# Altium schematic sheet Synchronous Buck Solar Charge Controller Board.SchDoc
size OrCAD B
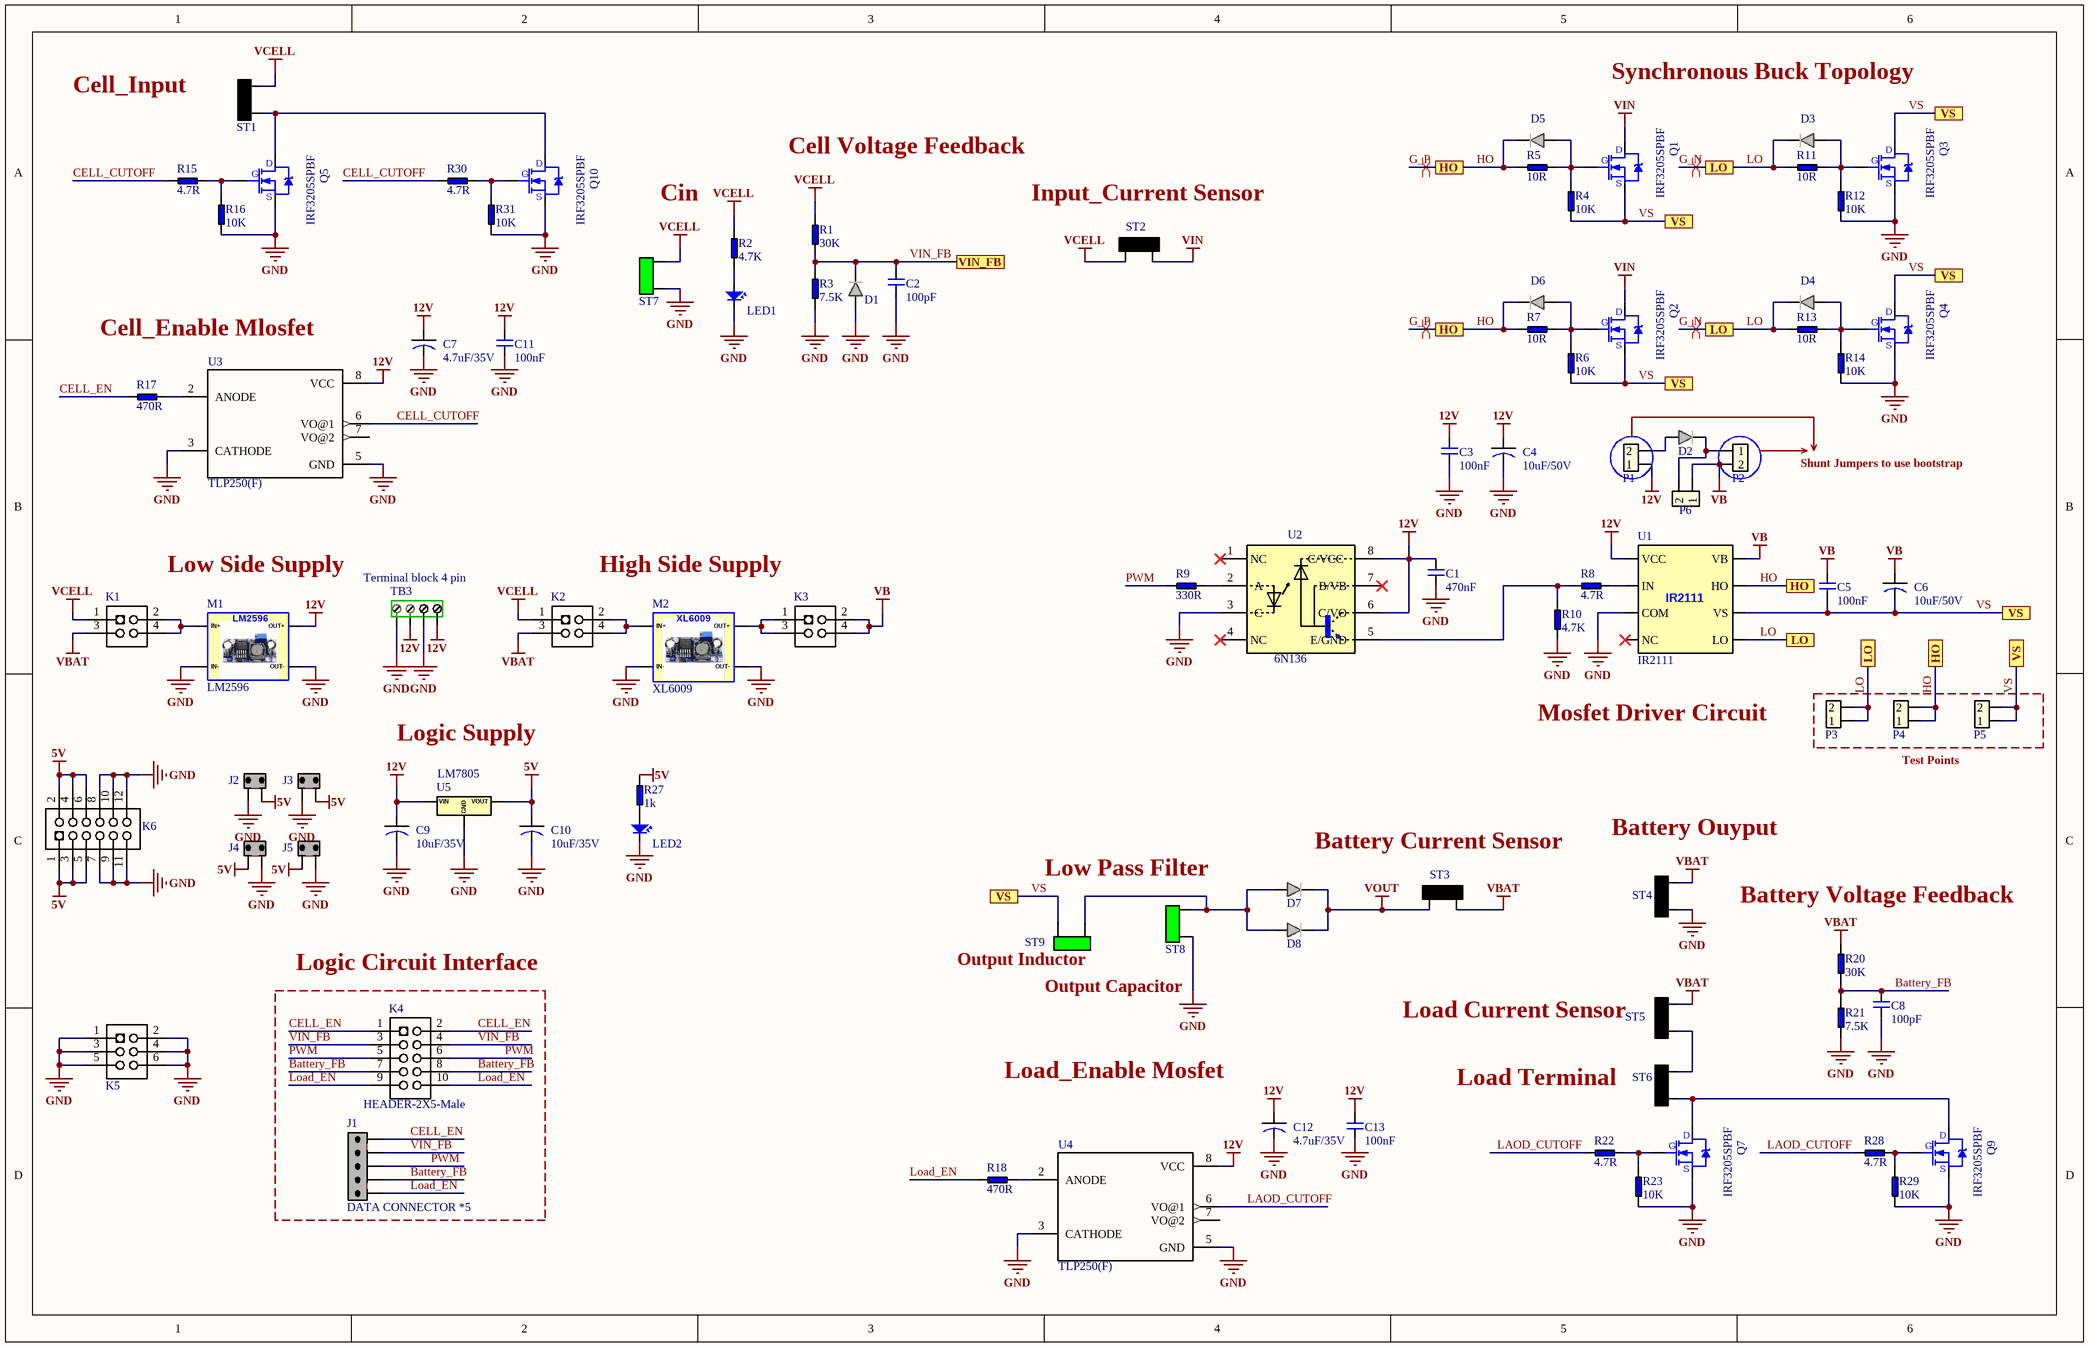
[diagram p0: Synchronous Buck Solar Charge Controller Board.SchDoc]

## Parts
C1  470nF  [CCAP 0.1 N Y]
C2  100pF  [CCAP 0.1 N Y]
C3  100nF  [CCAP 0.1 N Y]
C4  10uF/50V  [ECAP 5X11X2MM]
C5  100nF  [CCAP 0.1 N Y]
C6  10uF/50V  [ECAP 5X11X2MM]
C7  4.7uF/35V  [ECAP 5X11X2MM]
C8  100pF  [CCAP 0.1 N Y]
C9  10uF/35V  [ECAP 5X11X2MM]
C10  10uF/35V  [ECAP 5X11X2MM]
C11  100nF  [CCAP 0.1 N Y]
C12  4.7uF/35V  [ECAP 5X11X2MM]
C13  100nF  [CCAP 0.1 N Y]
D1  DIODE  [DIODE-1N400X_0.1]  (value not drawn)
D2  DIODE  [DIODE-1n400X_0.3]  (value not drawn)
D3  DIODE  [DIODE-1n400X_0.3]  (value not drawn)
D4  DIODE  [DIODE-1n400X_0.3]  (value not drawn)
D5  DIODE  [DIODE-1n400X_0.3]  (value not drawn)
D6  DIODE  [DIODE-1n400X_0.3]  (value not drawn)
D7  10A DIODE  [DIODE 10A 0.75]  (value not drawn)
D8  10A DIODE  [DIODE 10A 0.75]  (value not drawn)
J1  DATA CONNECTOR *5  [MOLEX *5_DATA CONNECTOR]
J2  DATA CONNECTOR *2  [MOLEX *2_DATA CONNECTOR]  (value not drawn)
J3  DATA CONNECTOR *2  [MOLEX *2_DATA CONNECTOR]  (value not drawn)
J4  DATA CONNECTOR *2  [MOLEX *2_DATA CONNECTOR]  (value not drawn)
J5  DATA CONNECTOR *2  [MOLEX *2_DATA CONNECTOR]  (value not drawn)
K1  HEADER-2X2-Male  [HEADER-2X2]  (value not drawn)
K2  HEADER-2X2-Male  [HEADER-2X2]  (value not drawn)
K3  HEADER-2X2-Male  [HEADER-2X2]  (value not drawn)
K4  HEADER-2X5-Male  [HEADER-2X5]
K5  HEADER-2X3-Male  [HEADER-2X3]  (value not drawn)
K6  HEADER-2X6-Male  [HEADER-2X6]  (value not drawn)
LED1  LED  [LED 3MM GREEN]  (value not drawn)
LED2  LED  [LED 3MM BLUE]  (value not drawn)
M1  LM2596  [LM2956S BUCK CONVETER]
M2  XL6009  [DC TO DC CONVERTER XL6009]
P1  Header - 2 - Male  [PINHEADER X2]  (value not drawn)
P2  Header - 2 - Male  [PINHEADER X2]  (value not drawn)
P3  Header - 2 - Male  [PINHEADER X2]  (value not drawn)
P4  Header - 2 - Male  [PINHEADER X2]  (value not drawn)
P5  Header - 2 - Male  [PINHEADER X2]  (value not drawn)
P6  Header - 2 - Male  [PINHEADER X2]  (value not drawn)
Q1  IRF3205SPBF  [Transistor/Heatsink -TO-220]
Q2  IRF3205SPBF  [Transistor/Heatsink -TO-220]
Q3  IRF3205SPBF  [Transistor/Heatsink -TO-220]
Q4  IRF3205SPBF  [Transistor/Heatsink -TO-220]
Q5  IRF3205SPBF  [Transistor/Heatsink -TO-220]
Q7  IRF3205SPBF  [Transistor/Heatsink -TO-220]
Q9  IRF3205SPBF  [Transistor/Heatsink -TO-220]
Q10  IRF3205SPBF  [Transistor/Heatsink -TO-220]
R1  30K  [RESISTOR _0]
R2  4.7K  [RESISTOR _1]
R3  7.5K  [RESISTOR _0]
R4  10K  [RESISTOR _1]
R5  10R  [RESISTOR _1]
R6  10K  [RESISTOR _1]
R7  10R  [RESISTOR _1]
R8  4.7R  [RESISTOR _0]
R9  330R  [RESISTOR _0]
R10  4.7K  [RESISTOR _0]
R11  10R  [RESISTOR _1]
R12  10K  [RESISTOR _1]
R13  10R  [RESISTOR _1]
R14  10K  [RESISTOR _1]
R15  4.7R  [RESISTOR _0]
R16  10K  [RESISTOR _0]
R17  470R  [RESISTOR _0]
R18  470R  [RESISTOR _0]
R20  30K  [RESISTOR _1]
R21  7.5K  [RESISTOR _1]
R22  4.7R  [RESISTOR _0]
R23  10K  [RESISTOR _0]
R27  1k  [RESISTOR _0]
R28  4.7R  [RESISTOR _0]
R29  10K  [RESISTOR _0]
R30  4.7R  [RESISTOR _0]
R31  10K  [RESISTOR _0]
ST1  SCREW TERMINAL  [SCREW TERMINAL]  (value not drawn)
ST2  SCREW TERMINAL  [SCREW TERMINAL]  (value not drawn)
ST3  SCREW TERMINAL  [SCREW TERMINAL]  (value not drawn)
ST4  SCREW TERMINAL  [SCREW TERMINAL]  (value not drawn)
ST5  SCREW TERMINAL  [SCREW TERMINAL]  (value not drawn)
ST6  SCREW TERMINAL  [SCREW TERMINAL]  (value not drawn)
ST7  2 Pole Power Terminal  [Screw Terminal Green]  (value not drawn)
ST8  2 Pole Power Terminal  [Screw Terminal Green]  (value not drawn)
ST9  2 Pole Power Terminal  [Screw Terminal Green]  (value not drawn)
TB3  Terminal block 4 pin  [AK500/4_BLUE]
U1  IR2111  [IC_DIP8]
U2  6N136  [IC_DIP8]
U3  TLP250(F)  [IC_DIP8]
U4  TLP250(F)  [IC_DIP8]
U5  LM7805  [V-REG/Heatsink - TO - 220]

## Blocks framed on the sheet
Logic Circuit Interface: J1 K4

## Ports
HO, LO, VIN_FB, VS

## Nets
5V: C10.A J2.1 J3.1 J4.2 J5.2 K6.1 K6.2 K6.3 K6.4 K6.5 K6.6 R27.2 U5.3(VOUT)
12V: C1.1 C3.1 C4.A C7.A C9.A C11.1 C12.A C13.1 M1.OUT+ P1.1 TB3.1 TB3.3 U1.1(VCC) U2.6(C/VO) U2.8(C/VCC) U3.8(VCC) U4.8(VCC) U5.1(VIN)
GND: C1.2 C2.2 C3.2 C4.K C7.K C8.2 C9.K C10.K C11.2 C12.K C13.2 D1.A J2.2 J3.2 J4.1 J5.1 K5.1 K5.2 K5.3 K5.4 K5.5 K5.6 K6.7 K6.8 K6.9 K6.10 K6.11 K6.12 LED1.K LED2.K M1.IN- M1.OUT- M2.IN- M2.OUT- Q3.3(S) Q4.3(S) Q5.3(S) Q7.3(S) Q9.3(S) Q10.3(S) R3.1 R10.1 R12.1 R14.1 R16.1 R21.1 R23.1 R29.1 R31.1 ST4.1(AC) ST7.1 ST8.1 TB3.2 TB3.4 U1.3(COM) U2.3(C) U3.3(CATHODE) U3.5(GND) U4.3(CATHODE) U4.5(GND) U5.2(GND)
VB: C5.1 C6.A K3.2 K3.4 P2.2 P6.1 U1.8(VB)
VBAT: K1.3 K2.3 R20.2 ST3.1(AC) ST4.2(AC) ST5.2(AC)
VCELL: K1.1 K2.1 R1.2 R2.2 ST1.1(AC) ST2.2(AC) ST7.2
VIN: Q1.2(D) Q2.2(D) ST2.1(AC)
VOUT: D7.K D8.K ST3.2(AC)
Battery_FB: C8.1 J1.4 K4.7 K4.8 R20.1 R21.2
CELL_CUTOFF: R15.1 R30.1 U3.6(VO@1)
CELL_EN: J1.1 K4.1 K4.2 R17.1
G_N: D3.K D4.K P3.1 P3.2 R11.1 R13.1 U1.4(LO) ; port LO  [also labelled LO]
G_P: D5.K D6.K P4.1 P4.2 R5.1 R7.1 U1.7(HO) ; port HO  [also labelled HO]
LAOD_CUTOFF: R22.1 R28.1 U4.6(VO@1)
Load_EN: J1.5 K4.9 K4.10 R18.1
PWM: J1.3 K4.5 K4.6 R9.1
VIN_FB: C2.1 D1.K J1.2 K4.3 K4.4 R1.1 R3.2 ; port VIN_FB
VS: C5.2 C6.K P5.1 P5.2 Q1.3(S) Q2.3(S) Q3.2(D) Q4.2(D) R4.2 R6.2 ST9.2 U1.6(VS) ; port VS
NetD2_A: D2.A P1.2
NetD2_K: D2.K P2.1 P6.2
NetD3_A: D3.A Q3.1(G) R11.2 R12.2
NetD4_A: D4.A Q4.1(G) R13.2 R14.2
NetD5_A: D5.A Q1.1(G) R4.1 R5.2
NetD6_A: D6.A Q2.1(G) R6.1 R7.2
NetD7_A: D7.A D8.A ST8.2 ST9.1
NetK1_2: K1.2 K1.4 M1.IN+
NetK2_2: K2.2 K2.4 M2.IN+
NetK3_1: K3.1 K3.3 M2.OUT+
NetLED1_A: LED1.A R2.1
NetLED2_A: LED2.A R27.1
NetQ5_1: Q5.1(G) R15.2 R16.2
NetQ5_2: Q5.2(D) Q10.2(D) ST1.2(AC)
NetQ7_1: Q7.1(G) R22.2 R23.2
NetQ7_2: Q7.2(D) Q9.2(D) ST6.1(AC)
NetQ9_1: Q9.1(G) R28.2 R29.2
NetQ10_1: Q10.1(G) R30.2 R31.2
NetR8_1: R8.1 R10.2 U2.5(E/GND)
NetR8_2: R8.2 U1.2(IN)
NetR9_2: R9.2 U2.2(A)
NetR17_2: R17.2 U3.2(ANODE)
NetR18_2: R18.2 U4.2(ANODE)
NetST5_1: ST5.1(AC) ST6.2(AC)

Not connected (* = marked no-connect by the designer): U1 5(NC)*; U2 1(NC)* 4(NC)* 7(B/VB)*; U3 7(VO@2); U4 7(VO@2)

## Layout directives
differential pair; rule Matched Net Lengths [Tolerance = 25.4mm]; differential pair class G: G_N, G_P

## Notes on the sheet
- Synchronous Buck Topology
- Cell_Input
- Cell Voltage Feedback
- Cin
- (near ST2) Input_Current Sensor
- Cell_Enable Mlosfet
- Shunt Jumpers to use bootstrap
- Low Side Supply
- High Side Supply
- Logic Supply
- Mosfet Driver Circuit
- Test Points
- (near ST8) Low Pass Filter
- Battery Current Sensor
- (near ST4) Battery Ouyput
- (near ST9) Output Inductor
- (near R20) Battery Voltage Feedback
- Output Capacitor
- (near ST5) Load Current Sensor
- Load_Enable Mosfet
- Load Terminal

## Library data of the parts
C1 = Ceramic_CAP_470nF
C2 C8 = Ceramic_CAP_100pF
C3 C5 C11 C13 = Ceramic_CAP_100nF
C4 C6 = ECAP-10uF-50V: 10uF ±20% 50V 5x11 1000Hrs @ 105℃ Radial,5x11mm Aluminum Electrolytic Capacitors - Leaded RoHS
C7 C12 = ECAP-4.7uF-35V: 4.7uF ±20% 35V 5x11 7000Hrs @ 105℃ Radial,5x11mm Aluminum Electrolytic Capacitors - Leaded RoHS
C9 C10 = ECAP-10uF-35V: 10uF ±20% 35V 5x11 2000Hrs @ 105℃ Radial,5x11mm Aluminum Electrolytic Capacitors - Leaded RoHS
D7 D8 = DIODE_10A05: 10A05-THRU-10A10 / VOLTAGE RANGE 50 to 1000 Volts CURRENT 10 Amperes
J1 = DATA CONNECTOR *5: Data Cable JST 5-pin
J2-J5 = DATA CONNECTOR *2: Data Cable JST 2-pin
M1 = DC TO DC CONVERTER LM2596: ADJUSTABLE DC/DC POWER CONVERTER
M2 = DC TO DC CONVERTER XL6009: ADJUSTABLE DC/DC POWER CONVERTER
P1-P6 = Header - 2 - Male: Header, 2-Pin; LatestRevisionDate: 17-Jul-2002; LatestRevisionNote: Re-released for DXP Platform.; Publisher: Altium Limited
Q1 Q2 = IRF3205SPBF: N-Channel 55V 110A _Tc_ 200W _Tc_ Surface Mount D2PAK; MF: Infineon Technologies; Price: None; Package: D2PAK Infineon; Availability: Unavailable; SnapEDA_Link: https://www.snapeda.com/parts/IRF3205SPBF/Infineon%20Technologies/view-part/576468/?ref=snap; MP: IRF3205SPBF; Value: *
Q3-Q5 Q7 Q9 Q10 = IRF3205SPBF: N-Channel 55V 110A 200W; MF: Infineon Technologies; Price: None; Package: D2PAK Infineon; Availability: Unavailable; SnapEDA_Link: https://www.snapeda.com/parts/IRF3205SPBF/Infineon%20Technologies/view-part/576468/?ref=snap; MP: IRF3205SPBF; Value: *
R1 R20 = RESISTOR_30K
R2 R10 = RESISTOR_4.7K
R3 R21 = RESISTOR_7.5K
R4 R6 R12 R14 R16 R23 R29 R31 = RESISTOR_10K
R5 R7 R11 R13 = RESISTOR_10R
R8 R15 R22 R28 R30 = RESISTOR_4.7R
R9 = RESISTOR_330R
R17 R18 = RESISTOR_470R
R27 = RESISTOR_1K
ST1-ST6 = SCREW TERMINAL: Barrier Terminal Block 2 Pin with cover 300V/25A
ST7-ST9 = Screw Terminal Green: KF762 Power Terminal Pitch 7.62mm Screw Block Connector 300V 20A 3Pin
TB3 = Terminal block 4 pin: Terminal Block 3 Pin 10A 300V
U1 = IR2111: IR2111 - 600 V 200/420 mA 20 V Supply Quad High And Low Side Driver - PDIP-8
U2 = 6N136: Optoisolator Transistor with Base Output 5300Vrms 1 Channel 8-DIP; MF: Vishay Semiconductor; Package: DIP-8 Vishay Semiconductor; MP: 6N136; Price: None; SnapEDA_Link: https://www.snapeda.com/parts/6N136/Vishay%20Semiconductor%20Opto%20Division/view-part/2773791/?ref=snap; Availability: Unavailable; Value: *
U3 U4 = TLP250(F): Optocoupler; THT; Out: IGBT driver; 2.5kV; DIP8; 1.5A; MF: Toshiba; MP: TLP250_F_; Availability: Unavailable; Package: DIP-8 Toshiba; Price: None; SnapEDA_Link: https://www.snapeda.com/parts/TLP250%28F%29/Toshiba%20Semiconductor%20and%20Storage/view-part/?ref=snap; Value: *
U5 = LM7805: 78xx Regulators